# EAGLE design SSB Transceiver_Mic. Amplifier (EAGLE 9.4.2)
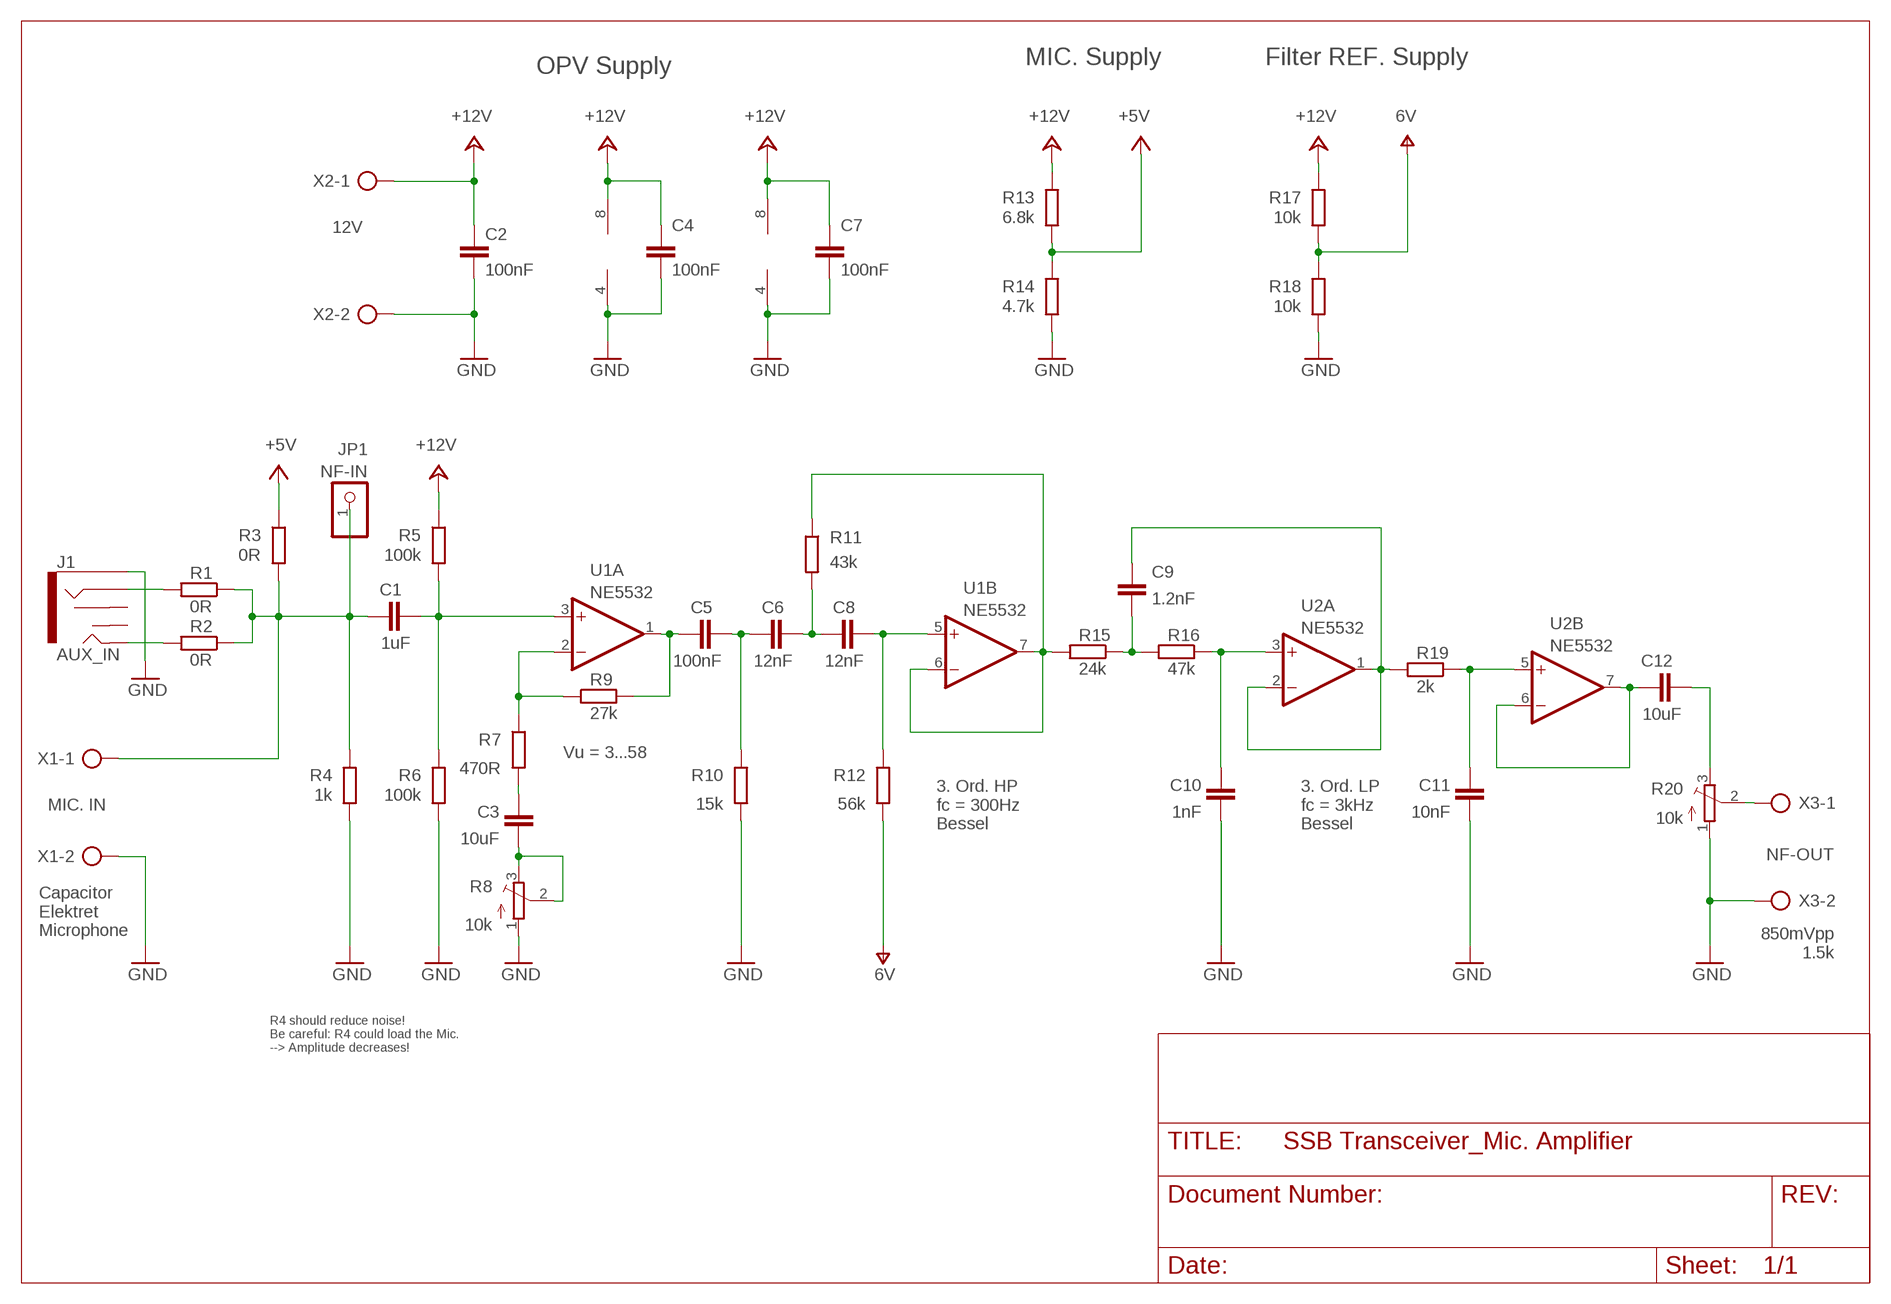
[diagram p0: schematic, sheet 1]

## Parts
C1  1uF  C-EUC0805  [C0805]
C2  100nF  C-EUC0805  [C0805]
C3  10uF  C-EUC0805  [C0805]
C4  100nF  C-EUC0805  [C0805]
C5  100nF  C-EUC0805  [C0805]
C6  12nF  C-EUC0805  [C0805]
C7  100nF  C-EUC0805  [C0805]
C8  12nF  C-EUC0805  [C0805]
C9  1.2nF  C-EUC0805  [C0805]
C10  1nF  C-EUC0805  [C0805]
C11  10nF  C-EUC0805  [C0805]
C12  10uF  C-EUC0805  [C0805]
J1  AUX_IN  AUDIO_JACK_3.5MM_PTH  [AUDIO-JACK]
JP1  NF-IN  PINHD-1X1  [1X01]
R1  0R  R-EU_R0805  [R0805]
R2  0R  R-EU_R0805  [R0805]
R3  0R  R-EU_R0805  [R0805]
R4  1k  R-EU_R0805  [R0805]
R5  100k  R-EU_R0805  [R0805]
R6  100k  R-EU_R0805  [R0805]
R7  470R  R-EU_R0805  [R0805]
R8  10k  TRIM_EU-3223G  [3223G]
R9  27k  R-EU_R0805  [R0805]
R10  15k  R-EU_R0805  [R0805]
R11  43k  R-EU_R0805  [R0805]
R12  56k  R-EU_R0805  [R0805]
R13  6.8k  R-EU_R0805  [R0805]
R14  4.7k  R-EU_R0805  [R0805]
R15  24k  R-EU_R0805  [R0805]
R16  47k  R-EU_R0805  [R0805]
R17  10k  R-EU_R0805  [R0805]
R18  10k  R-EU_R0805  [R0805]
R19  2k  R-EU_R0805  [R0805]
R20  10k  TRIM_EU-3223G  [3223G]
U1  NE5532  TL072D  [SO08]
U2  NE5532  TL072D  [SO08]
X1  MIC. IN  AK550/2  [AK550/2]
X2  12V  AK550/2  [AK550/2]
X3  NF-OUT  AK550/2  [AK550/2]

## Nets
+5V: R3.1 R13.2 R14.1
+24V: C2.2 C4.2 C7.2 R5.1 R13.1 R17.1 U1.8(P:V+) U2.8(P:V+) X2.1 ; supply symbol labelled +12V
GND: C2.1 C4.1 C7.1 C10.1 C11.1 J1.SLEEVE R4.2 R6.2 R8.1(A) R10.2 R14.2 R18.2 R20.1(A) U1.4(P:V-) U2.4(P:V-) X1.2 X2.2 X3.2
N$1: J1.RING R1.2
N$2: J1.TIP R2.2
N$3: R7.1 R9.1 U1.2(A:-IN)
N$4: C1.1 JP1.1 R1.1 R2.1 R3.2 R4.1 X1.1
N$5: C1.2 R5.2 R6.1 U1.3(A:+IN)
N$6: C3.2 R7.2
N$7: C3.1 R8.2(S) R8.3(E)
N$8: C5.1 R9.2 U1.1(A:OUT)
N$9: C5.2 C6.1 R10.1
N$10: C12.1 U2.6(B:-IN) U2.7(B:OUT)
N$11: R20.2(S) X3.1
N$12: C12.2 R20.3(E)
N$13: R11.1 R15.2 U1.6(B:-IN) U1.7(B:OUT)
N$14: C6.2 C8.1 R11.2
N$15: C8.2 R12.1 U1.5(B:+IN)
N$16: C9.1 R15.1 R16.2
N$17: C10.2 R16.1 U2.3(A:+IN)
N$18: C9.2 R19.2 U2.1(A:OUT) U2.2(A:-IN)
N$19: C11.2 R19.1 U2.5(B:+IN)
V+: R12.2 R17.2 R18.1 ; supply symbol labelled 6V
Unconnected: J1.RSH J1.TSH

## Notes on the sheet
- MIC. Supply | Filter REF. Supply
- OPV Supply
- Vu = 3...58
- 3. Ord. HP
  fc = 300Hz
  Bessel
- 3. Ord. LP
  fc = 3kHz
  Bessel
- 850mVpp
  1.5k
- Capacitor 
  Elektret 
  Microphone
- R4 should reduce noise!
  Be careful: R4 could load the Mic. 
  --> Amplitude decreases!

## Library data of the parts
C1-C12 = rcl:C-EU: CAPACITOR, European symbol; SPICEPREFIX: C
J1 = SparkFun-Connectors:AUDIO_JACK_3.5MM: Audio Jack 3.5mm variants of PTH and SMT stereo audio jack with bypass switches. SparkFun Products: SparkFun SparkPunk Sound Kit <[https://www.sparkfun.com/products/11177]> - PTH MP3 Trigger <https://www.sparkfun.com/products/13720> -3.5mm SMD SparkFun PicoBoard <https://www.sparkfun.com/products/11888>- 2.5mm SMD; PROD_ID: CONN-08774; SF_ID: PRT-08032
JP1 = pinhead:PINHD-1X1: PIN HEADER
R1-R7 R9-R19 = rcl:R-EU_: RESISTOR, European symbol; SPICEPREFIX: R
R8 R20 = pot:TRIM_EU-: POTENTIOMETER
U1 U2 = linear:TL072: OP AMP
X1-X3 = con-ptr500:AK550/2: CONNECTOR; OC_FARNELL: unknown; OC_NEWARK: unknown

## Board
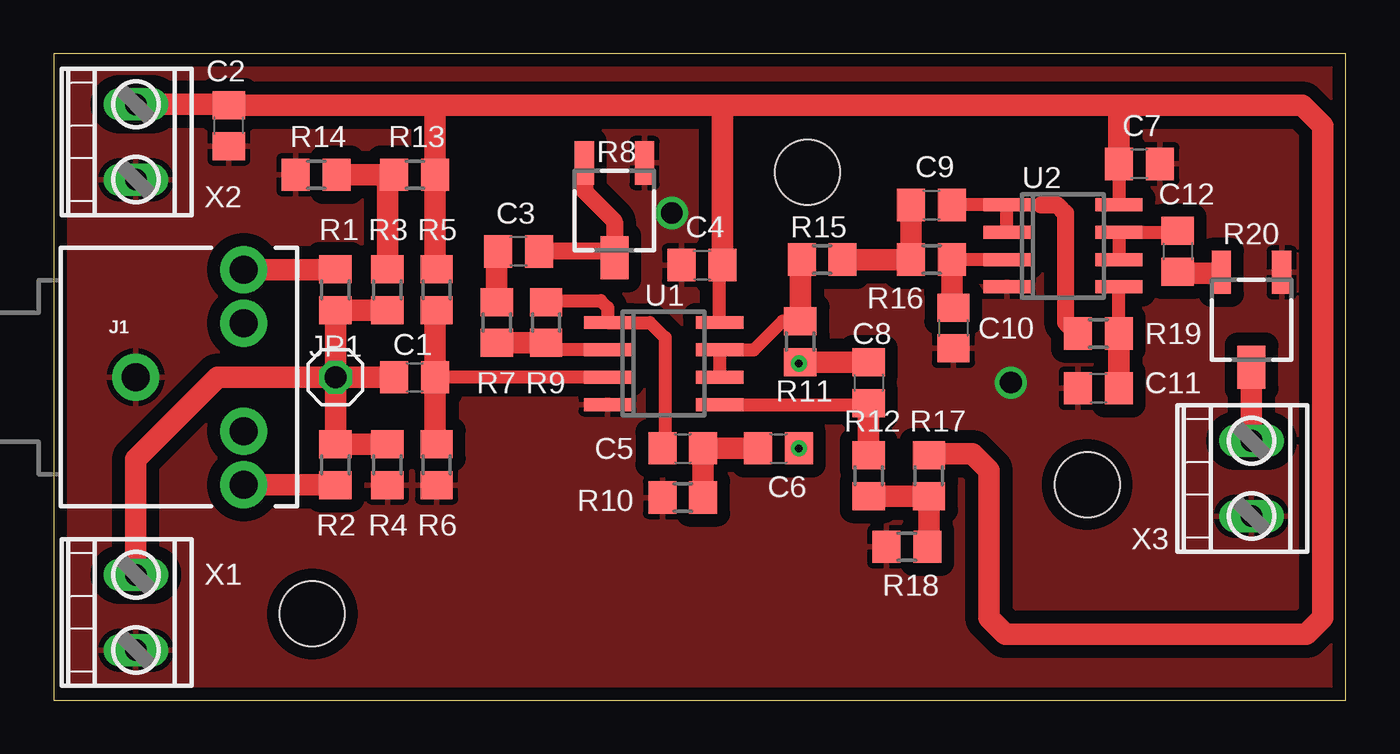
[diagram p1: board, top side]
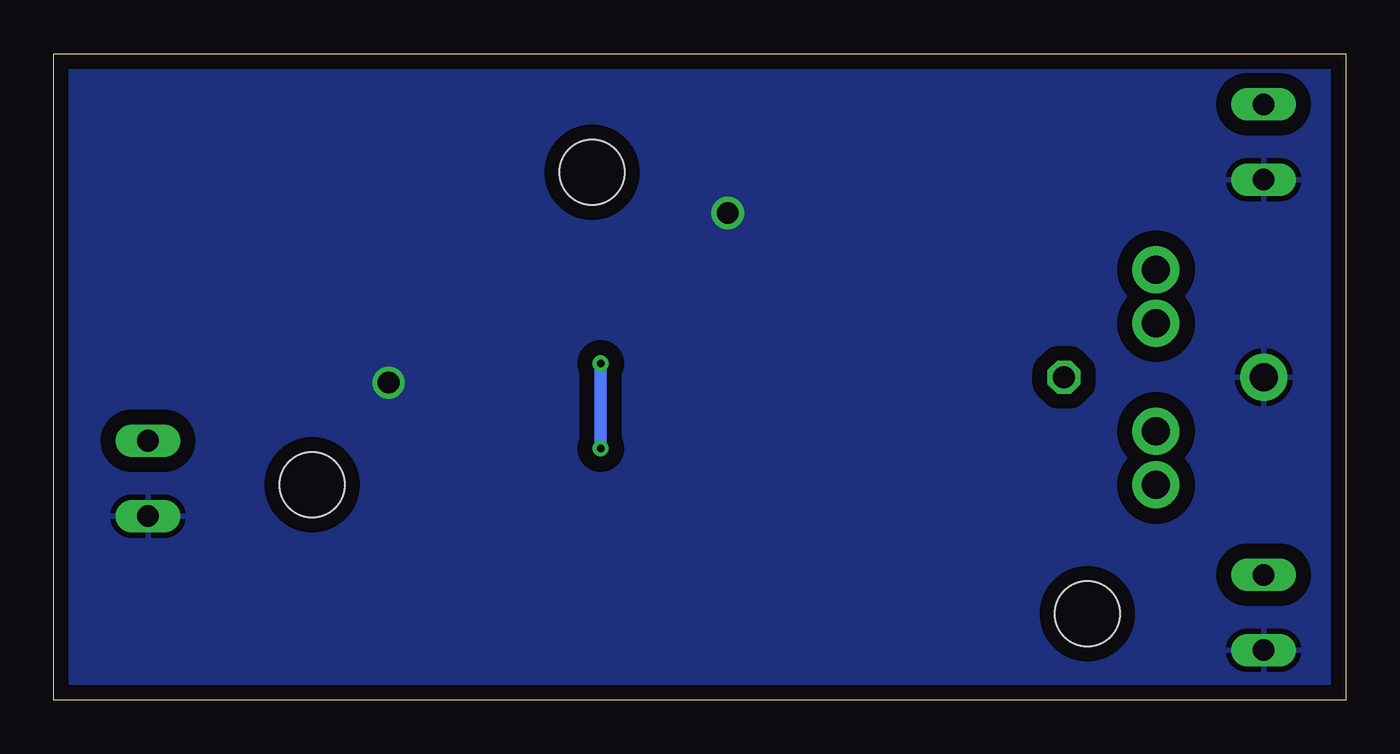
[diagram p2: board, bottom side, seen from below]

Size 60 x 30 mm. Coordinates in mm from the lower left corner, seen from the top.
Outline: 0,0 60,0 60,30 0,30 0,0
Copper layers (1*16): Top 0.035mm / dielectric 1.5mm / Bottom 0.035mm
Design rules "default *": minimum track width 23mil, minimum drill 0.35mm, track to track 20mil, track to pad 20mil, pad to pad 20mil, via to via 20mil, smd to smd 6mil, copper to edge 20mil, drill to drill 6mil, minimum pad ring 10mil, minimum via ring 8mil, stop-mask expansion 4mil, vias tented up to drill 0mil, thermal gap 10mil
Holes 3 mm at 12,4 35,24.5 48,10

### Footprints (pad centres in the part's own frame; a part is rotated, then mirrored left to right if it is on the bottom)
C0805 = smd 1.3 x 1.5: 1 -0.95,0; 2 0.95,0
AUDIO-JACK = drill 1.3 pad 2.184: RING 5,5; RSH 5,2.5; SLEEVE 0,0; TIP 5,-5; TSH 5,-2.5
1X01 = drill 1.016 octagon: 1 0,0
R0805 = smd 1.3 x 1.5: 1 -0.95,0; 2 0.95,0
3223G = smd 2 x 0.9: 1 -2.2,1.4; 3 -2.2,-1.4 | smd 2 x 1.3: 2 2.2,0
SO08 = smd 0.6 x 2.2: 1 -1.905,-2.6; 2 -0.635,-2.6; 3 0.635,-2.6; 4 1.905,-2.6; 5 1.905,2.6; 6 0.635,2.6; 7 -0.635,2.6; 8 -1.905,2.6
AK550/2 = drill 1 pad 1.5 long: 1 -1.75,0; 2 1.75,0

### Placement (x,y rotation side)
C1  16.76,14.99 0 top
C2  8.13,26.67 90 top
C3  21.59,20.83 180 top
C4  30.1,20.19 0 top
C5  29.21,11.68 0 top
C6  33.66,11.68 0 top
C7  50.42,24.89 180 top
C8  37.85,14.73 270 top
C9  40.77,22.99 0 top
C10  41.78,17.27 90 top
C11  48.51,14.48 0 top
C12  52.2,20.83 270 top
J1  3.81,14.99 0 top
JP1  13.08,14.99 0 top
R1  13.08,19.05 90 top
R2  13.08,10.92 270 top
R3  15.49,19.05 270 top
R4  15.49,10.92 270 top
R5  17.78,19.05 270 top
R6  17.78,10.92 270 top
R7  20.57,17.53 90 top
R8  26.04,22.73 270 top
R9  22.86,17.53 90 top
R10  29.21,9.4 180 top
R11  34.67,16.64 270 top
R12  37.85,10.41 270 top
R13  16.76,24.38 180 top
R14  12.19,24.38 180 top
R15  35.69,20.45 180 top
R16  40.77,20.45 180 top
R17  40.64,10.41 270 top
R18  39.62,7.11 180 top
R19  48.51,17.02 180 top
R20  55.63,17.65 270 top
U1  28.32,15.62 270 top
U2  46.86,21.08 270 top
X1  3.81,4.06 270 top
X2  3.81,25.91 270 top
X3  55.63,10.29 270 top

### Tracks (layer width: path | path; a pad name or v marks a point on that pad's centre or on a via)
+5V
  Top 1: R3.1 15.49,24.06 | 15.49,24.06 R13.2 | R14.1 15.17,24.38 15.49,24.06
+24V
  Top 0.6: C7.2 U2.8 | U1.8 30.92,20.07 C4.2
  Top 1: 17.78,27.62 C2.2 8.09,27.66 X2.1 | R5.1 17.71,20.07 R13.1 17.71,27.55 17.78,27.62 | 17.78,27.62 30.99,27.62 31.05,27.56 | R17.1 40.71,11.43 42.67,11.43 43.43,10.67 43.43,3.81 44.2,3.05 58.17,3.05 58.93,3.81 58.93,26.67 57.98,27.62 49.53,27.62 | C4.2 31.05,27.56 | 31.05,27.56 31.11,27.62 49.53,27.62 | C7.2 49.47,27.56 49.53,27.62
GND  (via drill 1)
  other vias: 28.7,22.61 44.45,14.73
  pour Top (isolate 0.6): 0,0 0,30 60,30 60,0
  pour Bottom (isolate 0.7): 0,0 0,30 60,30 60,0
N$1
  Top 1: J1.RING 13.07,19.99 R1.2
N$2
  Top 1: J1.TIP 13.07,9.99 R2.2
N$3
  Top 0.6: U1.2 23.18,16.26 R9.1
  Top 1: R9.1 R7.1
N$4
  Top 1: R3.2 R1.1 JP1.1 | JP1.1 R2.1 R4.1 | C1.1 JP1.1 | X1.1 3.81,11.18 7.62,14.99 JP1.1
N$5
  Top 0.6: U1.3 C1.2
  Top 1: R5.2 17.71,18.03 C1.2 17.71,11.94 R6.1
N$6
  Top 1: R7.2 20.57,20.76 C3.2
N$7
  Top 0.8: C3.1 26.04,20.83 R8.2 26.04,22.23 24.64,23.62 R8.3
N$8
  Top 0.6: R9.2 22.93,18.54 25.4,18.54 25.72,18.22 U1.1 27.69,17.53 28.39,16.82 28.39,11.81 C5.1
N$9
  Top 1: C6.1 C5.2 R10.1
N$10
  Top 0.6: U2.6 U2.7 52.14,21.72
  Top 1: 52.14,21.72 C12.1
N$11
  Top 1: X3.1 R20.2
N$12
  Top 0.6: R20.3 53.76,19.85 53.72,19.81
  Top 1: 53.72,19.81 52.26,19.81 C12.2
N$13
  Top 0.6: U1.6 U1.7 32.51,16.26 33.84,17.59 R11.1
  Top 1: R11.1 34.67,20.38 R15.2
N$14  (via drill 0.35)
  Top 1: C8.1 R11.2 v34.6,15.62
  Bottom 0.584: v34.6,11.68 v34.6,15.62
N$15
  Top 0.6: C8.2 37.78,13.72 U1.5
  Top 1: C8.2 R12.1
N$16
  Top 1: C9.1 R16.2 R15.1
N$17
  Top 0.6: U2.3 R16.1
  Top 1: R16.1 41.72,18.29 C10.2
N$18
  Top 0.6: U2.1 45.85,22.99 | U2.2 U2.1 | U2.1 C9.2
  Top 0.8: 45.85,22.99 46.61,22.99 46.99,22.61 46.99,17.53 47.5,17.02 R19.2
N$19
  Top 0.6: R19.1 U2.5
  Top 1: R19.1 C11.2
V+
  Top 1: R12.2 R17.2 40.64,7.18 R18.1